# Altium project Soil_Moisture_Sensor.PrjPcb
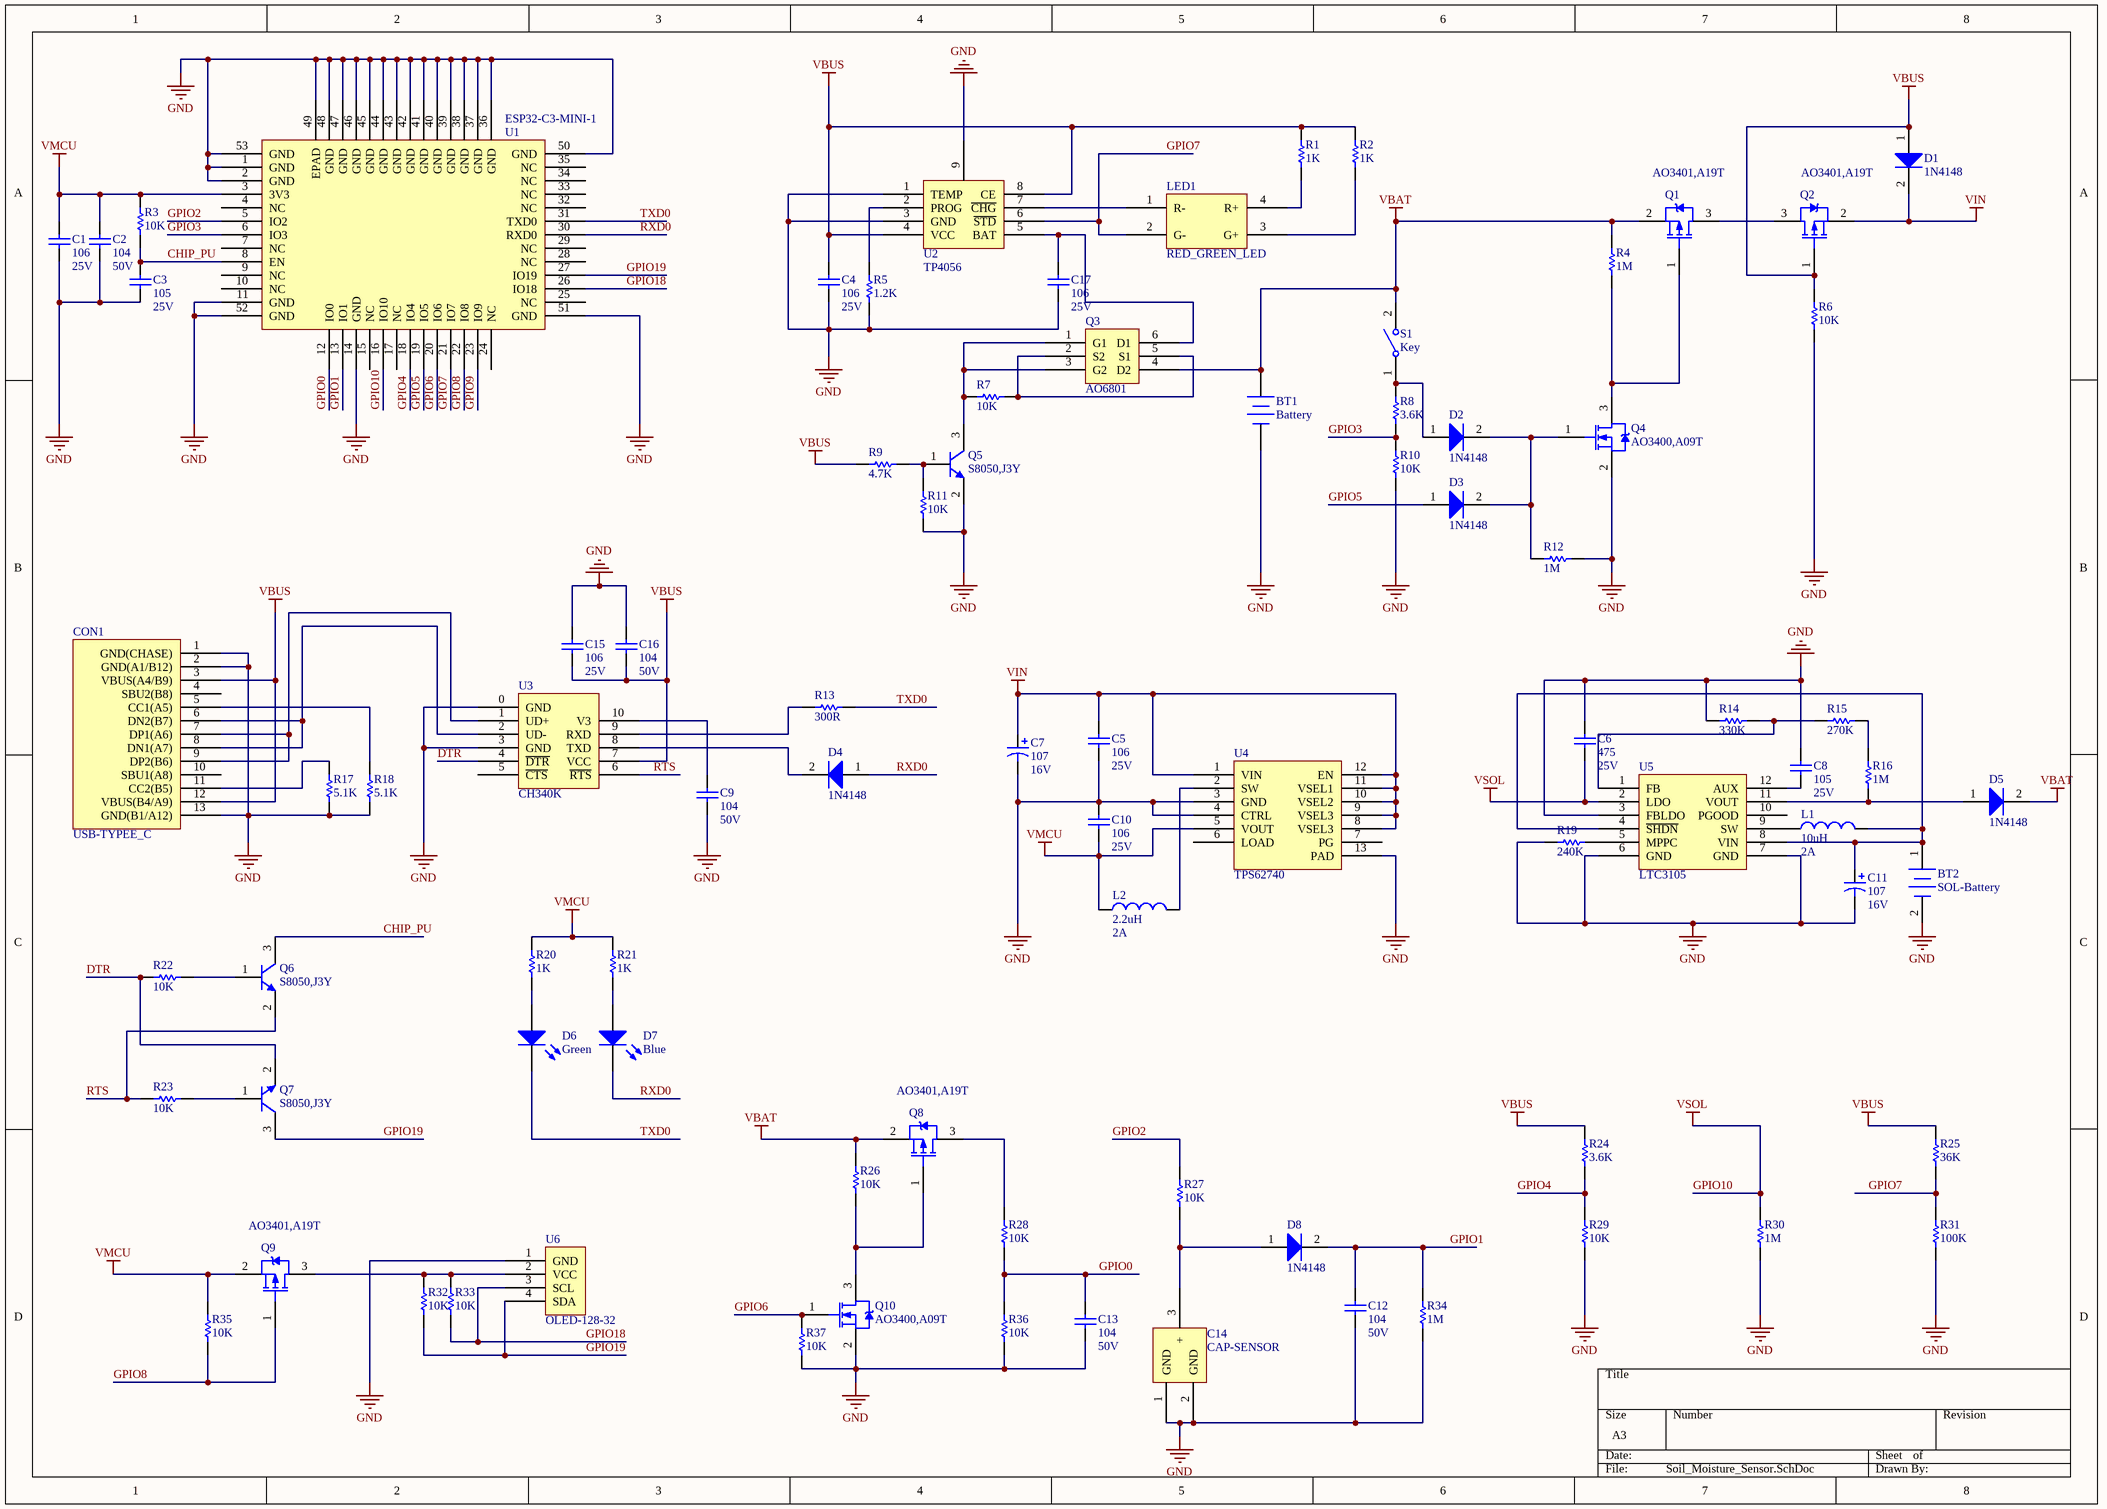
[diagram p0: Soil_Moisture_Sensor.SchDoc]
1 sheet, 85 parts. Net scope: global (net labels, ports and power ports of the same name join across sheets).
Board file: Soil_Moisture_Sensor.PcbDoc

## Sheet Soil_Moisture_Sensor.SchDoc
size A3; SheetNumber: 1; SheetTotal: 1

### Parts
BT1  Battery  [BATTERY]
BT2  SOL-Battery  [BATTERY-SOL]
C1  25V  value 106  [CAPC1608L]
C2  50V  value 104  [CAPC1608L]
C3  25V  value 105  [CAPC1608L]
C4  25V  value 106  [CAPC1608L]
C5  25V  value 106  [CAPC1608L]
C6  25V  value 475  [CAPC1608L]
C7  16V  value 107  [TC6032-2412]
C8  25V  value 105  [CAPC1608L]
C9  50V  value 104  [CAPC1608L]
C10  25V  value 106  [CAPC1608L]
C11  16V  value 107  [TC6032-2412]
C12  50V  value 104  [CAPC1608L]
C13  50V  value 104  [CAPC1608L]
C14  CAP-SENSOR  [CAP-SENSOR]
C15  25V  value 106  [CAPC1608L]
C16  50V  value 104  [CAPC1608L]
C17  25V  value 106  [CAPC1608L]
CON1  USB-TYPEE_C  [USB-TYPE_C]
D1  1N4148  [CD3216-1206]
D2  1N4148  [CD3216-1206]
D3  1N4148  [CD3216-1206]
D4  1N4148  [CD3216-1206]
D5  1N4148  [CD3216-1206]
D6  Green  [CD1608-0603]
D7  Blue  [CD1608-0603]
D8  1N4148  [CD3216-1206]
L1  2A  value 10uH  [INDC2520X06N]
L2  2A  value 2.2uH  [INDC2520X06N]
LED1  RED_GREEN_LED  [RED_GREEN_LED1206]
Q1  AO3401,A19T  [SOT-23B_L]
Q2  AO3401,A19T  [SOT-23B_L]
Q3  AO6801  [SOT95P330-6M]
Q4  AO3400,A09T  [SOT-23B_L]
Q5  S8050,J3Y  [SOT-23B_L]
Q6  S8050,J3Y  [SOT-23B_L]
Q7  S8050,J3Y  [SOT-23B_L]
Q8  AO3401,A19T  [SOT-23B_L]
Q9  AO3401,A19T  [SOT-23B_L]
Q10  AO3400,A09T  [SOT-23B_L]
R1  value 1K  [RESC1608L]  (hidden comment: Res1)
R2  value 1K  [RESC1608L]  (hidden comment: Res1)
R3  value 10K  [RESC1608L]  (hidden comment: Res1)
R4  value 1M  [RESC1608L]  (hidden comment: Res1)
R5  value 1.2K  [RESC1608L]  (hidden comment: Res1)
R6  value 10K  [RESC1608L]  (hidden comment: Res1)
R7  value 10K  [RESC1608L]  (hidden comment: Res1)
R8  value 3.6K  [RESC1608L]  (hidden comment: Res1)
R9  value 4.7K  [RESC1608L]  (hidden comment: Res1)
R10  value 10K  [RESC1608L]  (hidden comment: Res1)
R11  value 10K  [RESC1608L]  (hidden comment: Res1)
R12  value 1M  [RESC1608L]  (hidden comment: Res1)
R13  value 300R  [RESC1608L]  (hidden comment: Res1)
R14  value 330K  [RESC1608L]  (hidden comment: Res1)
R15  value 270K  [RESC1608L]  (hidden comment: Res1)
R16  value 1M  [RESC1608L]  (hidden comment: Res1)
R17  value 5.1K  [RESC1608L]  (hidden comment: Res1)
R18  value 5.1K  [RESC1608L]  (hidden comment: Res1)
R19  value 240K  [RESC1608L]  (hidden comment: Res1)
R20  value 1K  [RESC1608L]  (hidden comment: Res1)
R21  value 1K  [RESC1608L]  (hidden comment: Res1)
R22  value 10K  [RESC1608L]  (hidden comment: Res1)
R23  value 10K  [RESC1608L]  (hidden comment: Res1)
R24  value 3.6K  [RESC1608L]  (hidden comment: Res1)
R25  value 36K  [RESC1608L]  (hidden comment: Res1)
R26  value 10K  [RESC1608L]  (hidden comment: Res1)
R27  value 10K  [RESC1608L]  (hidden comment: Res1)
R28  value 10K  [RESC1608L]  (hidden comment: Res1)
R29  value 10K  [RESC1608L]  (hidden comment: Res1)
R30  value 1M  [RESC1608L]  (hidden comment: Res1)
R31  value 100K  [RESC1608L]  (hidden comment: Res1)
R32  value 10K  [RESC1608L]  (hidden comment: Res1)
R33  value 10K  [RESC1608L]  (hidden comment: Res1)
R34  value 1M  [RESC1608L]  (hidden comment: Res1)
R35  value 10K  [RESC1608L]  (hidden comment: Res1)
R36  value 10K  [RESC1608L]  (hidden comment: Res1)
R37  value 10K  [RESC1608L]  (hidden comment: Res1)
S1  Key  [KEY]
U1  ESP32-C3-MINI-1  [XCVR_ESP32-C3-MINI-1-N4]
U2  TP4056  [SOP127P780-8M]
U3  CH340K  [ESOP100-10]
U4  TPS62740  [DSS0012A]
U5  LTC3105  [TSOP65P490X110-12L]
U6  OLED-128-32  [OLED-128-32]

### Nets
GND: BT1.2(-) BT2.2(-) C1.1 C2.1 C3.1 C4.1 C5.1 C6.2 C7.2 C8.2 C9.1 C10.2 C11.2 C12.1 C13.1 C14.1(GND) C14.2(GND) C15.2 C16.2 C17.1 CON1.1(GND(CHASE)) CON1.2(GND(A1/B12)) CON1.13(GND(B1/A12)) Q4.2(S) Q5.2(E) Q10.2(S) R5.1 R6.1 R10.1 R11.2 R12.1 R14.2 R17.1 R18.1 R19.1 R29.1 R30.1 R31.1 R34.1 R36.1 R37.1 U1.1(GND) U1.2(GND) U1.11(GND) U1.14(GND) U1.36(GND) U1.37(GND) U1.38(GND) U1.39(GND) U1.40(GND) U1.41(GND) U1.42(GND) U1.43(GND) U1.44(GND) U1.45(GND) U1.46(GND) U1.47(GND) U1.48(GND) U1.49(EPAD) U1.50(GND) U1.51(GND) U1.52(GND) U1.53(GND) U2.1(TEMP) U2.3(GND) U2.9 U3.0(GND) U3.3(GND) U4.3(GND) U4.4(CTRL) U4.13(PAD) U5.3(FBLDO) U5.6(GND) U5.7(GND) U6.1(GND)
GPIO10: C6.1 R30.2 U1.16(IO10) U5.2(LDO)  [also labelled VSOL]
VBAT: BT1.1(+) D5.2(K) Q1.2(S) Q3.4(D2) Q8.2(S) R4.2 R26.2 S1.2(NO)
VBUS: C4.2 C15.1 C16.1 CON1.3(VBUS(A4/B9)) CON1.12(VBUS(B4/A9)) D1.1(A) Q2.1(G) R1.2 R2.2 R6.2 R9.2 R24.2 R25.2 U2.4(VCC) U2.8(CE) U3.7(VCC)
VIN: C5.2 C7.1 D1.2(K) Q2.2(S) U4.1(VIN) U4.8(VSEL3) U4.9(VSEL3) U4.10(VSEL2) U4.11(VSEL1) U4.12(EN)
VMCU: C1.2 C2.2 C10.1 L2.1 Q9.2(S) R3.2 R20.1 R21.1 R35.2 U1.3(3V3) U4.5(VOUT)
CHIP_PU: C3.2 Q6.3(C) R3.1 U1.8(EN)
DTR: Q7.2(E) R22.2 U3.4(~{DTR})
GPIO0: C13.2 R28.1 R36.2 U1.12(IO0)
GPIO1: C12.2 D8.2(K) R34.2 U1.13(IO1)
GPIO2: R27.2 U1.5(IO2)
GPIO3: R8.1 R10.2 U1.6(IO3)
GPIO4: R24.1 R29.2 U1.18(IO4)
GPIO5: D3.1(A) U1.19(IO5)
GPIO6: Q10.1(G) R37.2 U1.20(IO6)
GPIO7: LED1.2(G-) R25.1 R31.2 U1.21(IO7) U2.6(~{STD})
GPIO8: Q9.1(G) R35.1 U1.22(IO8)
GPIO9: U1.23(IO9)
GPIO18: R33.2 U1.26(IO18) U6.3(SCL)
GPIO19: Q7.3(C) R32.2 U1.27(IO19) U6.4(SDA)
RTS: Q6.2(E) R23.2 U3.6(~{RTS})
RXD0: D4.1(A) D7.2(K) U1.30(RXD0)
TXD0: D6.2(K) R13.1 U1.31(TXD0)
NetBT2_1: BT2.1(+) C11.1 L1.2 U5.4(~{SHDN}) U5.8(VIN)
NetC8_1: C8.1 U5.12(AUX)
NetC9_2: C9.2 U3.10(V3)
NetC14_3: C14.3(+) D8.1(A) R27.1
NetC17_2: C17.2 Q3.6(D1) U2.5(BAT)
NetCON1_5: CON1.5(CC1(A5)) R18.2
NetCON1_6: CON1.6(DN2(B7)) CON1.8(DN1(A7)) U3.2(UD-)
NetCON1_7: CON1.7(DP1(A6)) CON1.9(DP2(B6)) U3.1(UD+)
NetCON1_11: CON1.11(CC2(B5)) R17.2
NetD2_1: D2.1(A) R8.2 S1.1(COMMON)
NetD2_2: D2.2(K) D3.2(K) Q4.1(G) R12.2
NetD4_2: D4.2(K) U3.8(TXD)
NetD5_1: D5.1(A) R16.2 U5.11(VOUT)
NetD6_1: D6.1(A) R20.2
NetD7_1: D7.1(A) R21.2
NetL1_1: L1.1 U5.9(SW)
NetL2_2: L2.2 U4.2(SW)
NetLED1_1: LED1.1(R-) U2.7(~{CHG})
NetLED1_3: LED1.3(G+) R2.1
NetLED1_4: LED1.4(R+) R1.1
NetQ1_1: Q1.1(G) Q4.3(D) R4.1
NetQ1_3: Q1.3(D) Q2.3(D)
NetQ3_1: Q3.1(G1) Q3.3(G2) Q5.3(C) R7.2
NetQ3_2: Q3.2(S2) Q3.5(S1) R7.1
NetQ5_1: Q5.1(B) R9.1 R11.1
NetQ6_1: Q6.1(B) R22.1
NetQ7_1: Q7.1(B) R23.1
NetQ8_1: Q8.1(G) Q10.3(D) R26.1
NetQ8_3: Q8.3(D) R28.2
NetQ9_3: Q9.3(D) R32.1 R33.1 U6.2(VCC)
NetR5_2: R5.2 U2.2(PROG)
NetR13_2: R13.2 U3.9(RXD)
NetR14_1: R14.1 R15.1 U5.1(FB)
NetR15_2: R15.2 R16.1
NetR19_2: R19.2 U5.5(MPPC)

Not connected (* = marked no-connect by the designer): CON1 4(SBU2(B8)) 10(SBU1(A8)); U1 4(NC) 7(NC) 9(NC) 10(NC) 15(NC) 17(NC) 24(NC) 25(NC) 28(NC) 29(NC) 32(NC) 33(NC) 34(NC) 35(NC); U3 5(~{CTS}); U4 6(LOAD) 7(PG); U5 10(PGOOD)

### Library data of the parts
BT1 BT2 = Battery: Multicell Battery; Published: 24-Mar-1999; LatestRevisionDate: 17-Jul-2002; LatestRevisionNote: Re-released for DXP Platform.; PackageReference: BAT-2; Publisher: Altium Limited; PackageDescription: Battery; 2 Leads
C1-C6 C8-C10 C12 C13 C15-C17 = Cap: Capacitor; Published: 8-Jun-2000; LatestRevisionDate: 17-Jul-2002; LatestRevisionNote: Re-released for DXP Platform.; PackageReference: RAD-0.3; Publisher: Altium Limited; PackageDescription: Radial Cap, Thru-Hole; 2 Leads; 0.3 in Pin Spacing
C7 C11 = Cap Pol1: Polarized Capacitor (Radial); Published: 8-Jun-2000; LatestRevisionDate: 17-Jul-2002; LatestRevisionNote: Re-released for DXP Platform.; PackageReference: RB7.6-15; Publisher: Altium Limited; PackageDescription: Polarized Capacitor (Radial); 2 Leads
D1-D5 D8 = Diode: Default Diode; Published: 8-Jun-2000; LatestRevisionDate: 17-Jul-2002; LatestRevisionNote: Re-released for DXP Platform.; PackageVersion: Sep-1996; PackageReference: SMC; Publisher: Altium Limited; PackageDescription: DO-214-AB/SMC; 2 C-Bend Leads; Body 7.9 x 5.9 mm, inc. leads (LxW); Code_JEDEC: DO-214-AB
D6 D7 = LED0: Typical INFRARED GaAs LED; Published: 8-Jun-2000; LatestRevisionDate: 08-Jul-2005; LatestRevisionNote: Mech Layer 1 removed.; PackageReference: LED-0; Publisher: Altium Limited; PackageDescription: LED; 2 Leads
L1 L2 = Inductor: Code_IEC: 1005; Published: 8-Jun-2000; LatestRevisionDate: 29-May-2009; LatestRevisionNote: IPC-7351 Footprint Added.; PackageReference: 0402-A; Publisher: Altium Limited; PackageDescription: Chip Inductor; Code_JEITA: 0402
Q1 Q2 Q8 Q9 = PMOS-2: P-Channel Power MOSFET; Note: Pin 4 not drawn and electrically connected to Pin 2.; Published: 8-Jun-2000; LatestRevisionDate: 17-Jul-2002; LatestRevisionNote: Re-released for DXP Platform.; DatasheetVersion: PD-9.390D; PackageVersion: Feb-1997; PackageReference: TO-220AB; Publisher: Altium Limited; PackageDescription: TO, Thru-Hole, Vertical, Heatsink Mounted; 3 In-Line Leads; Pitch 2.54 mm; ComponentLink1Description: Manufacturer Link; ComponentLink1URL: http://www.irf.com/
Q4 Q10 = NMOS-2: N-Channel Power MOSFET; Note: Pin 2 is electrically connected to pin 4.; Published: 8-Jun-2000; LatestRevisionDate: 17-Jul-2002; LatestRevisionNote: Re-released for DXP Platform.; DatasheetVersion: PD-9.814; PackageVersion: Feb-1997; PackageReference: TO-220AB; Publisher: Altium Limited; PackageDescription: TO, Thru-Hole, Vertical, Heatsink Mounted; 3 In-Line Leads; Pitch 2.54 mm; ComponentLink1Description: Manufacturer Link; ComponentLink1URL: http://www.irf.com/
Q5-Q7 = NPN: NPN Bipolar Transistor; Published: 8-Jun-2000; LatestRevisionDate: 17-Jul-2002; LatestRevisionNote: Re-released for DXP Platform.; PackageReference: TO-226-AA; Publisher: Altium Limited; PackageDescription: TO, Flat Index; 3 In-Line, Axial Leads; Body Dia. 4.8mm; Leads 0.55 x 0.51 mm (max); Code_JEDEC: TO-226-AA
R1-R37 = Res1: Resistor; Published: 8-Jun-2000; LatestRevisionDate: 17-Jul-2002; LatestRevisionNote: Re-released for DXP Platform.; PackageReference: AXIAL-0.3; Publisher: Altium Limited; PackageDescription: Axial Device, Thru-Hole; 2 Leads; 0.3 in Pin Spacing
S1 = SW-SPST: Single-Pole, Single-Throw Switch; Published: 24-Mar-1999; LatestRevisionDate: 17-Jul-2002; LatestRevisionNote: Re-released for DXP Platform.; PackageReference: SPST-2; Publisher: Altium Limited; PackageDescription: Switch; 2 Leads